# EAGLE design DIP_VERSION (EAGLE 9.6.2)
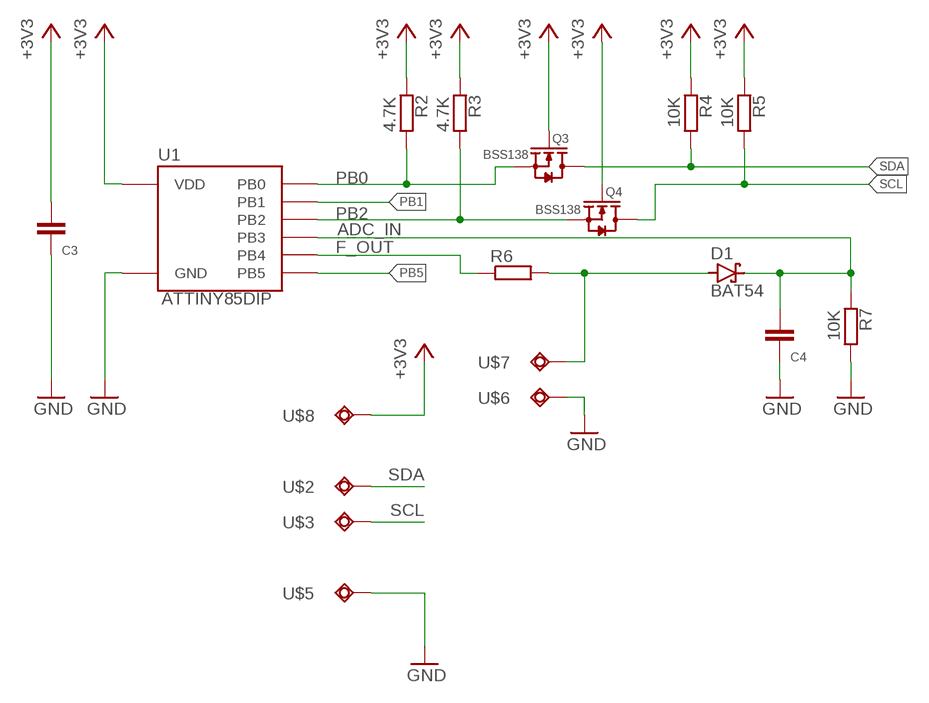
[diagram p0: schematic, sheet 1]

## Parts
C3  100nF 6.3V  CAP_CERAMIC_0805  [SMD_0805]
C4  10UF 6.3V  CAP_CERAMIC_0805  [SMD_0805]
D1  BAT54  [SOT23]
Q3  BSS138  SMD-MOSFET-N-CH-50V-200MA-BSS138W-7-F(SOT-23)  [SOT-23]
Q4  BSS138  SMD-MOSFET-N-CH-50V-200MA-BSS138W-7-F(SOT-23)  [SOT-23]
R2  4.7K  RESISTOR_0805  [SMD_0805]
R3  4.7K  RESISTOR_0805  [SMD_0805]
R4  10K  RESISTOR_0805  [SMD_0805]
R5  10K  RESISTOR_0805  [SMD_0805]
R6  6.25  RESISTOR_0805  [SMD_0805]
R7  10K  RESISTOR_0805  [SMD_0805]
U1  ATTINY85DIP  [DIP8]
U$2  PAD3.0X5.0  [PAD3X5]
U$3  PAD3.0X5.0  [PAD3X5]
U$5  PAD3.0X5.0  [PAD3X5]
U$6  PAD3.0X5.0  [PAD3X5]
U$7  PAD3.0X5.0  [PAD3X5]
U$8  PAD3.0X5.0  [PAD3X5]

## Nets
+3V3: C3.2 Q3.1(G) Q4.1(G) R2.1 R3.1 R4.1 R5.1 U1.8(VDD) U$8.P$1
ADC_IN: C4.2 D1.3(C) R7.1 U1.2(PB3)
F_OUT: R6.1 U1.3(PB4)
GND: C3.1 C4.1 R7.2 U1.4(GND) U$5.P$1 U$6.P$1
N$1: D1.1(A) R6.2 U$7.P$1
PB0: Q3.2(S) R2.2 U1.5(PB0)
PB1: U1.6(PB1)
PB2: Q4.2(S) R3.2 U1.7(PB2)
PB5: U1.1(PB5)
SCL: Q4.3(D) R5.2 U$3.P$1
SDA: Q3.3(D) R4.2 U$2.P$1

## Library data of the parts
C3 C4 = SIG_parts:CAP_CERAMIC_*
D1 = diode:BAT54: Schottky Diodes Source: Fairchild .. BAT54.pdf
Q3 Q4 = Seeed-Transistor:SMD-MOSFET-N-CH-50V-200MA-BSS138W-7-F(SOT-23): 305030000; MPN: BSS138W-7-F; VALUE: BSS138W-7-F
R2-R7 = SIG_parts:RESISTOR_*
U1 = SIG_parts:ATTINY85: The high-performance, low-power Microchip 8-bit AVR RISC-based microcontroller combines 8KB ISP flash memory, 512B EEPROM, 512-Byte SRAM, 6 general purpose I/O lines, 32 general purpose working registers, one 8-bit timer/counter with compare modes, one 8-bit high speed timer/counter, USI, internal and external Interrupts, 4-channel 10-bit A/D converter, programmable watchdog timer with internal oscillator, three software selectable power saving modes, and debugWIRE for on-chip debugging. The device achieves a throughput of 20 MIPS at 20 MHz and operates between 2.7-5.5 volts. https://www.microchip.com/wwwproducts/en/ATtiny85#datasheet-toggle
U$2 U$3 U$5-U$8 = SIG_parts:PAD3.0X5.0

## Board
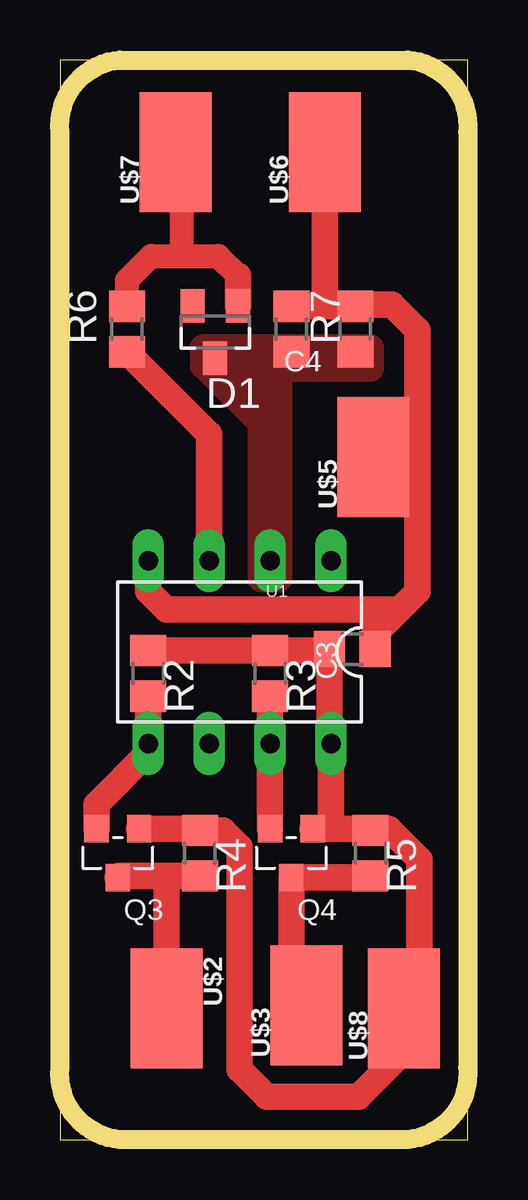
[diagram p1: board, top side]

Size 17 x 45 mm. Coordinates in mm from the lower left corner, seen from the top.
Outline: 0,0 17,0 17,45 0,45 0,0
Copper layers (1*16): Top 0.035mm / dielectric 0.15mm / Bottom 0.035mm
Design rules "default": minimum track width 6mil, minimum drill 0.35mm, track to track 6mil, track to pad 6mil, pad to pad 6mil, via to via 6mil, smd to smd 6mil, copper to edge 40mil, drill to drill 6mil, minimum pad ring 10mil, minimum via ring 8mil, stop-mask expansion 4mil, vias tented up to drill 0mil, thermal gap 10mil
Milling: 8 lines

### Footprints (pad centres in the part's own frame; a part is rotated, then mirrored left to right if it is on the bottom)
SMD_0805 = smd 1.3 x 1.5: 1 -0.95,0; 2 0.95,0
SOT23 = smd 1 x 1.4: 1 -0.95,-1.1; 2 0.95,-1.1; 3 0,1.1
SOT-23 = smd 1.016 x 1.143: 1 -0.889,-1.016; 2 0.889,-1.016; 3 0,1.016
DIP8 = drill 0.813 long: 1 -3.81,-3.81; 2 -1.27,-3.81; 3 1.27,-3.81; 4 3.81,-3.81; 5 3.81,3.81; 6 1.27,3.81; 7 -1.27,3.81; 8 -3.81,3.81
PAD3X5 = smd 5 x 3: P$1 0,0

### Placement (x,y rotation side)
C3  12.19,20.45 180 top
C4  9.65,33.78 270 top
D1  6.48,33.66 180 top
Q3  2.41,11.94 180 top
Q4  9.65,11.94 180 top
R2  3.68,19.43 270 top
R3  8.76,19.43 270 top
R4  5.84,11.94 270 top
R5  12.95,11.94 270 top
R6  2.79,33.78 90 top
R7  12.32,33.78 90 top
U1  7.49,20.32 180 top
U$2  4.45,5.46 270 top
U$3  10.29,5.59 90 top
U$5  13.08,28.45 90 top
U$6  11.05,41.15 90 top
U$7  4.83,41.15 90 top
U$8  14.35,5.46 90 top

### Tracks (layer width: path | path; a pad name or v marks a point on that pad's centre or on a via)
+3V3
  Top 1.1: Q4.1 11.3,12.95 | 11.3,12.95 12.89,12.95 | 12.89,12.95 R5.1 | Q3.1 5.78,12.95 R4.1 6.8,12.89 7.49,12.19 7.49,2.92 8.64,1.78 12.45,1.78 14.48,3.81 14.48,5.33 U$8.P$1 14.99,6.1 14.99,11.68 13.72,12.95 12.89,12.95 | R2.1 R3.1 11.18,20.38 C3.2 11.24,16.57 U1.8 11.3,12.95
ADC_IN
  pour Top (no thermals): 8.38,23.37 8.38,29.84 5.97,32.26 5.97,33.02 12.95,33.02 12.95,32.13 9.14,32.13 9.14,23.37
F_OUT
  Top 1.1: U1.3 6.22,29.4 R6.1
GND
  Top 1.1: 11.05,34.73 R7.2 12.38,34.8 13.84,34.8 14.9,33.74 14.9,28.32 | 11.05,34.73 C4.1 | U$6.P$1 11.05,34.73 | 13.14,22.1 C3.1 13.14,21.08 14.13,22.07 | 13.14,22.1 4.45,22.1 3.68,22.86 U1.4 | 14.13,22.07 14.9,22.84 14.9,28.32 | 13.14,22.1 14.1,22.1 14.13,22.07 | U$5.P$1 14.78,28.45 14.9,28.32
N$1
  Top 1: R6.2 2.79,35.81 3.81,36.83 5.08,36.83 | 5.08,36.83 6.6,36.83 7.43,36.01 | U$7.P$1 5.08,40.89 5.08,36.83
  Top 1.1: D1.1 7.43,36.01 | 4.7,39.37 4.7,41.02 U$7.P$1
PB0
  Top 1: 3.68,15.75 U1.5
  Top 1.1: Q3.2 1.52,13.97 3.68,16.13 U1.5 R2.2
PB2
  Top 1.1: Q4.2 U1.7 R3.2
SCL
  Top 1.1: R5.2 12.89,10.92 Q4.3 9.65,6.22 U$3.P$1
SDA
  Top 1.1: Q3.3 2.48,10.99 R4.2 4.45,10.99 U$2.P$1